# EAGLE schematic Control Estufa (EAGLE 8.2.2)
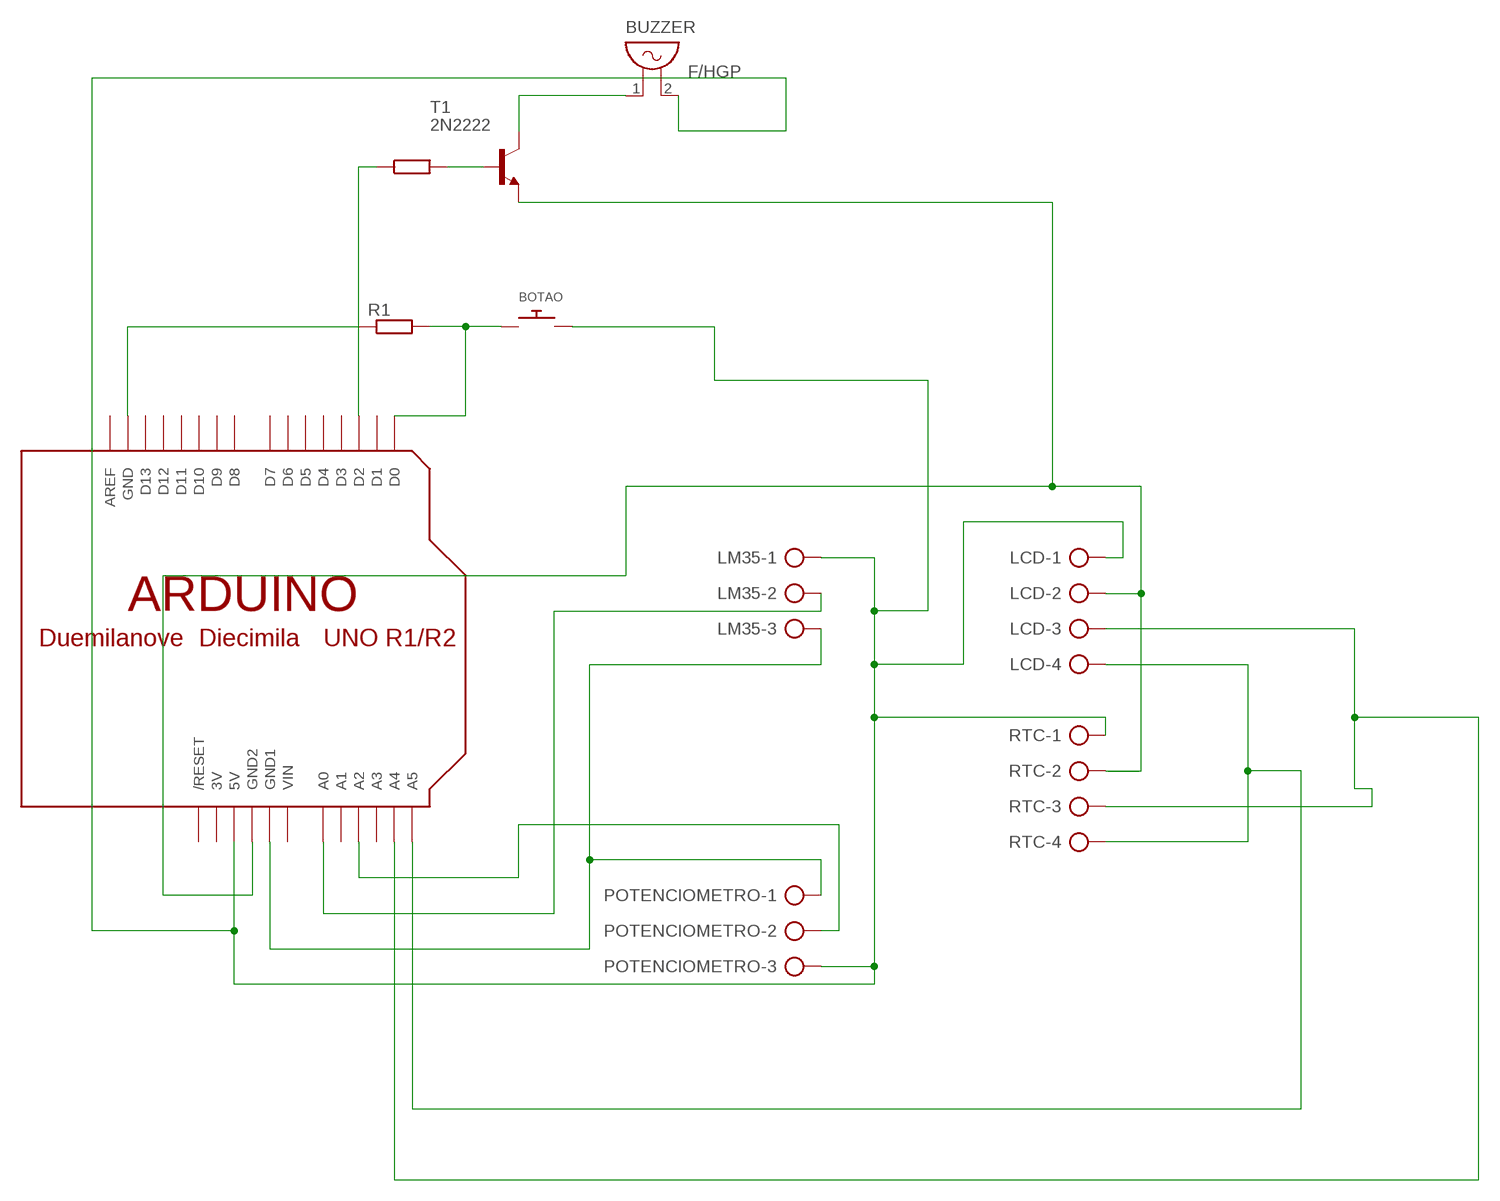
[diagram p0: schematic, sheet 1]

## Parts
BOTAO  SWITCH_PUSHBUTTONEVQ-PE  [TACT_PANA-EVQ]
BUZZER  F/HGP  [F/HGP]
LCD  AK500/4-H  [AK500/4-H]
LM35  AK500/3  [AK500/3]
POTENCIOMETRO  AK500/3  [AK500/3]
R1  R-EU_0207/10  [0207/10]
RTC  AK500/4-H  [AK500/4-H]
T1  2N2222  [TO92-EBC-OVAL]
U$1  ARDUINO-NOHOLE  [ARDUINO-NOHOLE]

## Nets
N$1: LM35.3 POTENCIOMETRO.1 U$1.GND1
N$2: BOTAO.P$2 BUZZER.2 LCD.1 LM35.1 POTENCIOMETRO.3 RTC.1 U$1.5V
N$3: LM35.2 U$1.A0
N$4: POTENCIOMETRO.2 U$1.A2
N$5: U$1.D2
N$6: LCD.3 RTC.3 U$1.A4
N$7: LCD.2 RTC.2 T1.E U$1.GND2
N$8: BOTAO.P$1 R1.2 U$1.D0
N$9: LCD.4 RTC.4 U$1.A5
N$10: R1.1 U$1.GND
N$11: T1.B
N$12: BUZZER.1 T1.C
Unconnected: U$1.A1 U$1.A3 U$1.AREF U$1.D1 U$1.D3 U$1.D4 U$1.D5 U$1.D6 U$1.D7 U$1.D8 U$1.D9 U$1.D10 U$1.D11 U$1.D12 U$1.D13 U$1.RESET(/RESET)

## Power pins joined to a net without a drawn wire
3V: U$1.3V
VIN: U$1.VIN

## Library data of the parts
BOTAO = adafruit:SWITCH_PUSHBUTTON: Buttons SOFTTOUCHSMD_SJ - Soft touch temporary push button (Super Junk Akihabara) Compatible with SKPMANE010 [Mouser: 688-SKPMAN] C&K_KSS = Digikey: KSS221GLFS
BUZZER = buzzer:F/HGP: BUZZER Source: Buerklin; OC_FARNELL: unknown; OC_NEWARK: unknown
LCD RTC = con-ptr500:AK500/4-H: CONNECTOR Aug. 2004 / PTR Meßtechnik: Die Bezeichnung der Serie AK505 wurde geändert. Es handelt sich hierbei um AK500 in horizontaler Ausführung.; OC_FARNELL: unknown; OC_NEWARK: unknown
LM35 POTENCIOMETRO = con-ptr500:AK500/3: CONNECTOR; OC_FARNELL: unknown; OC_NEWARK: unknown
R1 = resistor:R-EU_: RESISTOR, European symbol
T1 = adafruit:2N2222: NPN TRANSISTOR Big oval pads
U$1 = adafruit:ARDUINO: Arduino Diecimila/Duemilanove Make a shield with ease, this package has all the named pins as well as the two mounting drill holes and an outline of the USB and DC power connector. The outline is on the DIMENSION layer, so if your board house uses it they will cut the outline to match. http://www.ladyada.net/library/pcb/eaglelibrary.html